# EAGLE schematic isd1820-test-new (EAGLE 9.6.2)
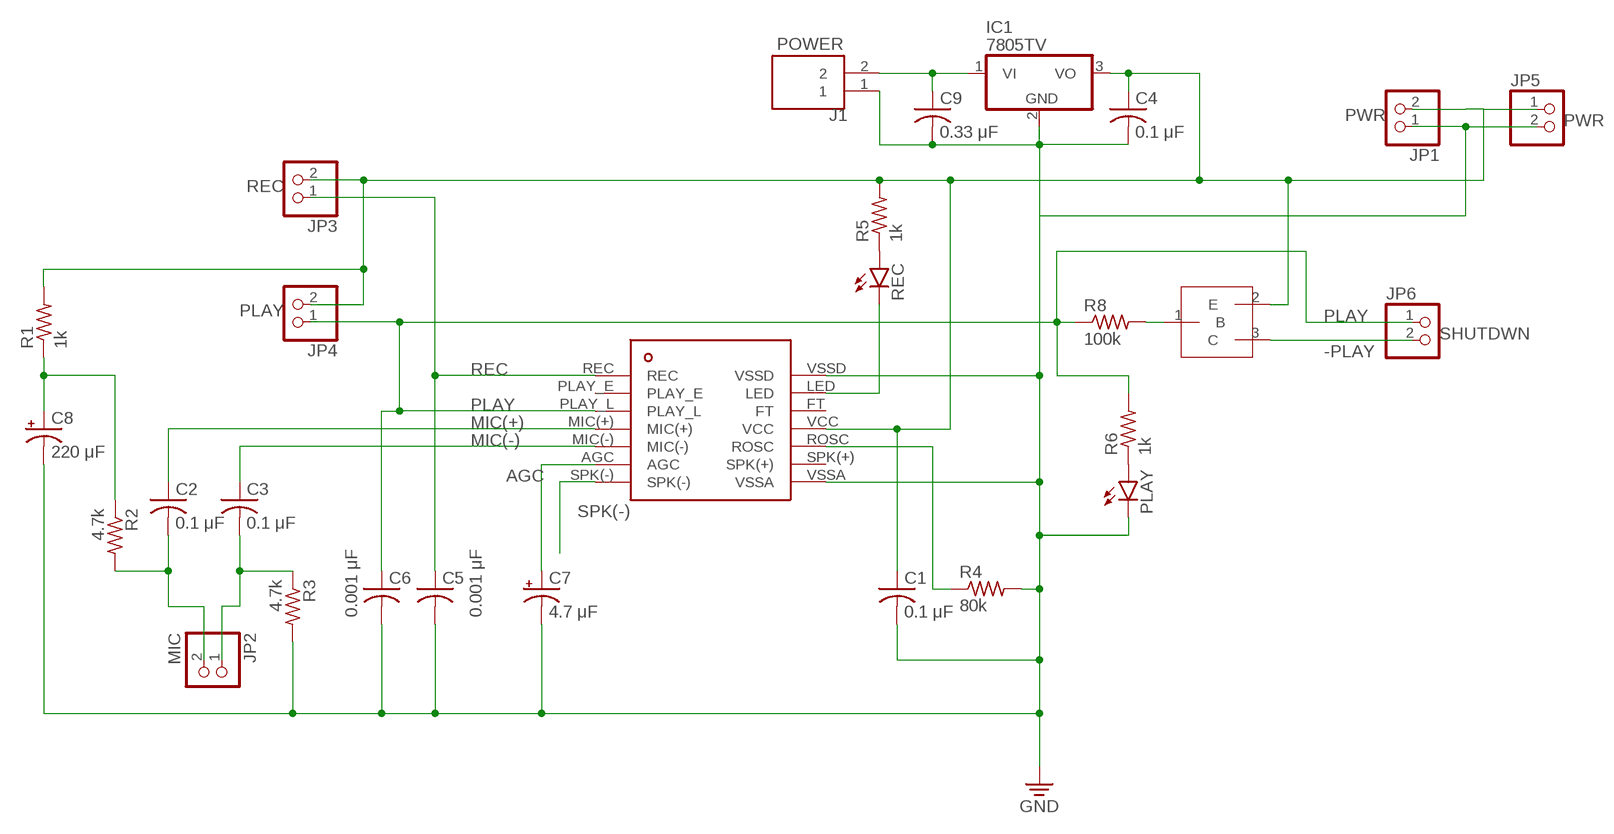
[diagram p0: schematic, sheet 1]

## Parts
C1  0.1 μF  C-USC0805  [C0805]
C2  0.1 μF  C-USC0805  [C0805]
C3  0.1 μF  C-USC0805  [C0805]
C4  0.1 μF  C-USC0805  [C0805]
C5  0.001 μF  C-USC0805  [C0805]
C6  0.001 μF  C-USC0805  [C0805]
C7  4.7 μF  C-POL-US_RADIAL-11MM-DIA  [CAPPRD508W65D1000H1100B]
C8  220 μF  C-POL-US_RADIAL-11MM-DIA  [CAPPRD508W65D1000H1100B]
C9  0.33 μF  C-USC0805  [C0805]
IC1  7805TV  [TO220V]
J1  POWER  TB004-508-02BE  [CUI_TB004-508-02BE]
JP1  PWR  PINHD-1X2  [1X02]
JP2  MIC  PINHD-1X2  [1X02]
JP3  REC  PINHD-1X2  [1X02]
JP4  PLAY  PINHD-1X2  [1X02]
JP5  PWR  PINHD-1X2  [1X02]
JP6  SHUTDWN  PINHD-1X2  [1X02]
PLAY  LEDCHIP-LED0805  [CHIP-LED0805]
R1  1k  R-US_R0805  [R0805]
R2  4.7k  R-US_R0805  [R0805]
R3  4.7k  R-US_R0805  [R0805]
R4  80k  R-US_R0805  [R0805]
R5  1k  R-US_R0805  [R0805]
R6  1k  R-US_R0805  [R0805]
R8  100k  R-US_R0805  [R0805]
REC  LEDCHIP-LED0805  [CHIP-LED0805]
U$1  ISD1820PY  [ISD1820PY]
U$2  2PB709ARL,235  [SOT95P230X110-3N]

## Nets
+5V: C1.1 C4.1 IC1.3(VO) JP1.2 JP3.2 JP4.2 JP5.1 R1.2 R5.2 U$1.VCC U$2.2(E)
-PLAY: JP6.2 U$2.3(C)
AGC: C7.1(+) U$1.AGC
GND: C1.2 C4.2 C5.2 C6.2 C7.2(-) C8.2(-) C9.2 IC1.2(GND) J1.1 JP1.1 JP5.2 PLAY.C R3.2 R4.2 U$1.VSSA U$1.VSSD
MIC(+): C2.1 U$1.MIC(+)
MIC(-): C3.1 U$1.MIC(-)
N$1: PLAY.A R6.1
N$3: R8.2 U$2.1(B)
N$5: R4.1 U$1.ROSC
N$8: C9.1 IC1.1(VI) J1.2
N$11: C3.2 JP2.1 R3.1
N$12: C2.2 JP2.2 R2.2
N$13: C8.1(+) R1.1 R2.1
N$15: R5.1 REC.A
N$17: REC.C U$1.LED
PLAY: C6.1 JP4.1 JP6.1 R6.2 R8.1 U$1.PLAY_L
REC: C5.1 JP3.1 U$1.REC
SPK(-): U$1.SPK(-)
Unconnected: U$1.FT U$1.PLAY_E U$1.SPK(+)

## Library data of the parts
C1-C6 C9 = rcl:C-US: CAPACITOR, American symbol; SPICEPREFIX: C
C7 C8 = Capacitor:C-POL-US: Capacitor Polarised - ANSI; CATEGORY: Capacitor
IC1 = linear:78*: Positive VOLTAGE REGULATOR Source: http://cache.national.com/ds/LM/LM78L05.pdf http://www.fairchildsemi.com/ds/LM/LM7805.pdf
J1 = TB004-508-02BE:TB004-508-02BE: Screw Terminal 5.08 pitch Check availability <https://pricing.snapeda.com/parts/TB004-508-02BE/CUI%20Devices/view-part?ref=eda>; AVAILABILITY: In Stock; CUI_PURCHASE_URL: https://www.cuidevices.com/product/interconnect/connectors/terminal-blocks/tb004-508-series?utm_source=snapeda.com&utm_medium=referral&utm_campaign=snapedaBOM; DESCRIPTION: 2~24 Poles, Screw Type, Horizontal, 5.08 Pitch, 24~12 (AWG), Terminal Block Connector; MF: CUI Devices; MP: TB004-508-02BE; PACKAGE: None; PRICE: None; PURCHASE-URL: https://pricing.snapeda.com/search/part/TB004-508-02BE/?ref=eda
JP1-JP6 = pinhead:PINHD-1X2: PIN HEADER
PLAY REC = led:LED: LED OSRAM: - CHIPLED LG R971, LG N971, LY N971, LG Q971, LY Q971, LO R971, LY R971 LH N974, LH R974 LS Q976, LO Q976, LY Q976 LO Q996 - Hyper CHIPLED LW Q18S LB Q993, LB Q99A, LB R99A - SideLED LS A670, LO A670, LY A670, LG A670, LP A670 LB A673, LV A673, LT A673, LW A673 LH A674 LY A675 LS A676, LA A676, LO A676, LY A676, LW A676 LS A679, LY A679, LG A679 - Hyper Micro SIDELED® LS Y876, LA Y876, LO Y876, LY Y876 LT Y87S - SmartLED LW L88C, LW L88S LB L89C, LB L89S, LG L890 LS L89K, LO L89K, LY L89K LS L896, LA L896, LO L896, LY L896 - TOPLED LS T670, LO T670, LY T670, LG T670, LP T670 LSG T670, LSP T670, LSY T670, LOP T670, LYG T670 LG T671, LOG T671, LSG T671 LB T673, LV T673, LT T673, LW T673 LH T674 LS T676, LA T676, LO T676, LY T676, LB T676, LH T676, LSB T676, LW T676 LB T67C, LV T67C, LT T67C, LS T67K, LO T67K, LY T67K, LW E67C LS E67B, LA E67B, LO E67B, LY E67B, LB E67C, LV E67C, LT E67C LW T67C LS T679, LY T679, LG T679 LS T770, LO T770, LY T770, LG T770, LP T770 LB T773, LV T773, LT T773, LW T773 LH T774 LS E675, LA E675, LY E675, LS T675 LS T776, LA T776, LO T776, LY T776, LB T776 LHGB T686 LT T68C, LB T68C - Hyper Mini TOPLED® LB M676 - Mini TOPLED Santana® LG M470 LS M47K, LO M47K, LY M47K Source: http://www.osram.convergy.de LUXEON: - LUMILED® LXK2-PW12-R00, LXK2-PW12-S00, LXK2-PW14-U00, LXK2-PW14-V00 LXK2-PM12-R00, LXK2-PM12-S00, LXK2-PM14-U00 LXK2-PE12-Q00, LXK2-PE12-R00, LXK2-PE12-S00, LXK2-PE14-T00, LXK2-PE14-U00 LXK2-PB12-K00, LXK2-PB12-L00, LXK2-PB12-M00, LXK2-PB14-N00, LXK2-PB14-P00, LXK2-PB14-Q00 LXK2-PR12-L00, LXK2-PR12-M00, LXK2-PR14-Q00, LXK2-PR14-R00 LXK2-PD12-Q00, LXK2-PD12-R00, LXK2-PD12-S00 LXK2-PH12-R00, LXK2-PH12-S00 LXK2-PL12-P00, LXK2-PL12-Q00, LXK2-PL12-R00 Source: www.luxeon.com KINGBRIGHT: KA-3528ASYC Source: www.kingbright.com
R1-R6 R8 = rcl:R-US_: RESISTOR, American symbol; SPICEPREFIX: R
U$1 = isd1820py:ISD1820PY
U$2 = 2PB709ARL,235-SOT23:2PB709ARL,235